# EasyEDA Pro project TJMakes_Xiao_Adapter.eprj

# Schematic schematic1
Create Date: 2024-02-23; Page Name: P1; Project Name: TJMakes_Xiao_Adapter; Schematic Name: schematic1; Update Date: 2024-02-27; Company: EasyEDA.com; Drawn: EasyEDA; Page Size: A4; Part Number: JLCPCB-002; Reviewed: EasyEDA; Version: V0.1
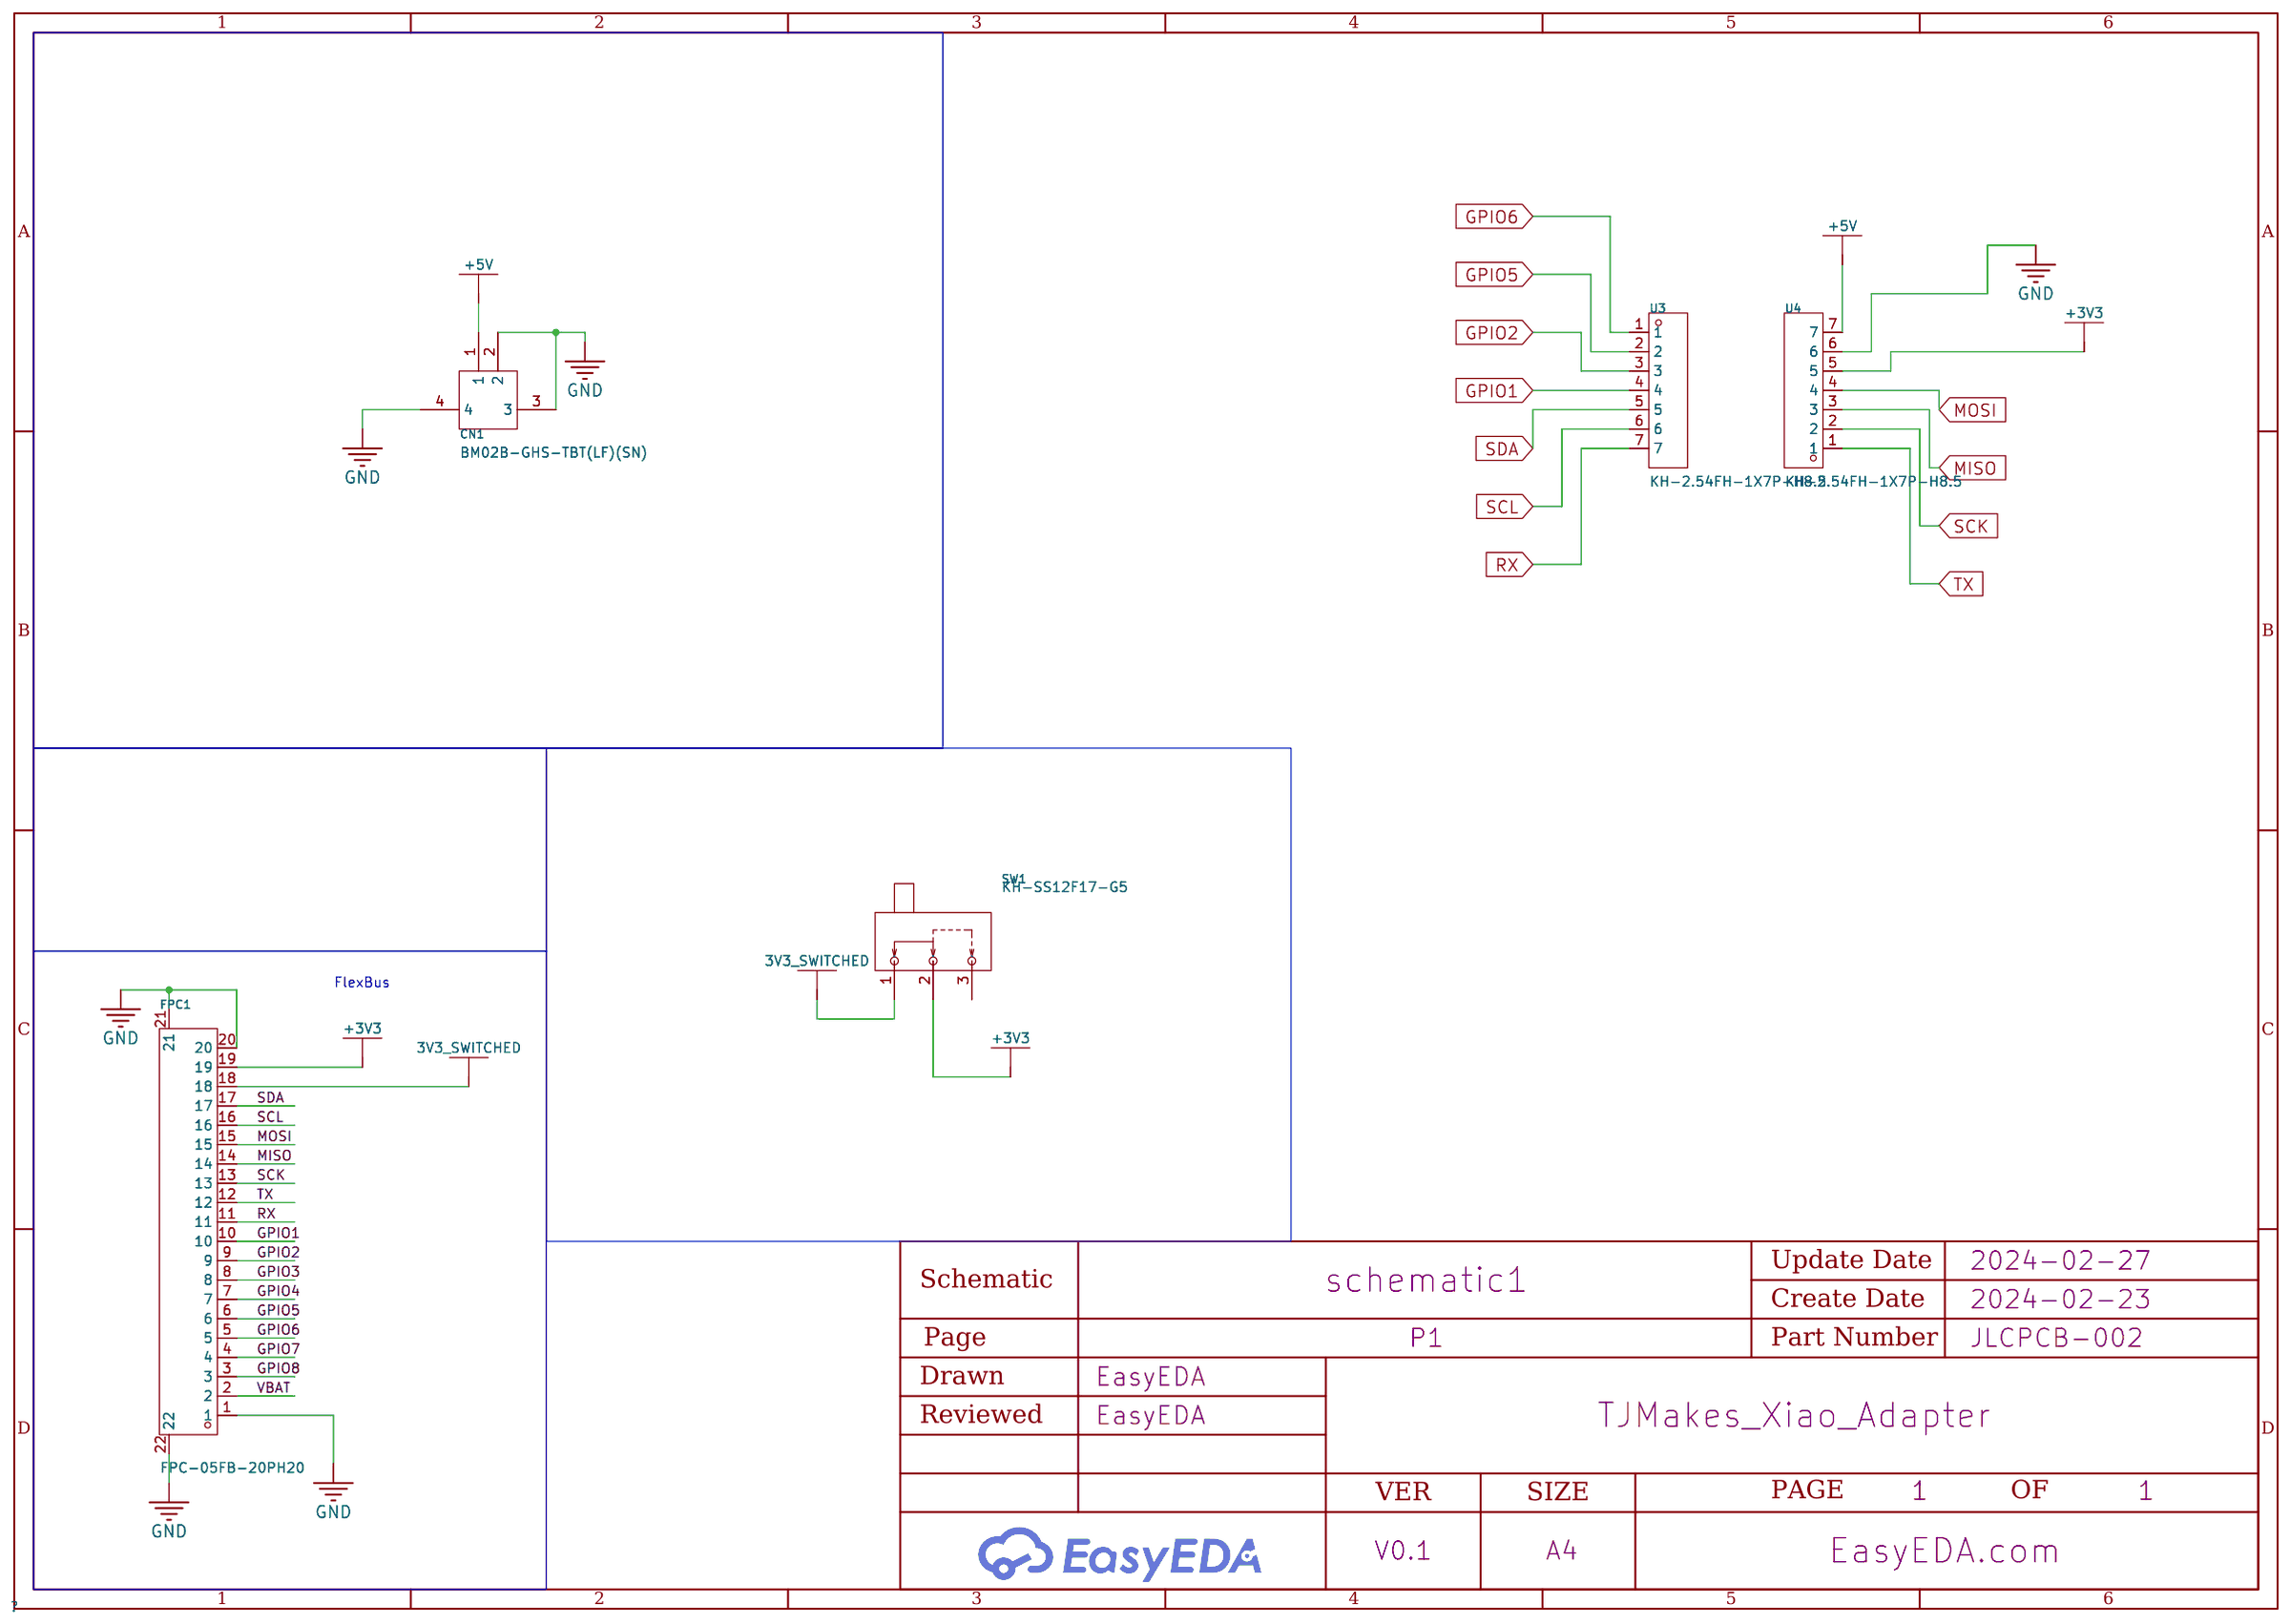
[diagram p0: schematic sheet]

## Parts
CN1  BM02B-GHS-TBT(LF)(SN)  [CONN-SMD_2P-P1.25_BM02B-GHS-TBT-LF-SN]
FPC1  FPC-05FB-20PH20  [FPC-SMD_20P-P0.50_FPC-05FB-20PH20]
SW1  KH-SS12F17-G5  [SW-TH_KH-SS12F17-G5]
U3  KH-2.54FH-1X7P-H8.5  [HDR-TH_7P-P2.54-V-F]
U4  KH-2.54FH-1X7P-H8.5  [HDR-TH_7P-P2.54-V-F]

## Library data of the parts
CN1 = BM02B-GHS-TBT(LF)(SN)_C161690: Pins Structure:1x2P Pitch:1.25mm Mounting Style:- Reference Series:GH Number of Pins:2P Number of Rows:1 Number of PINs Per Row:2 Row Spacing:- Contact Material:Phosphor bronze; LCSC Part Name: 系列:GH 间距:1.25mm 1x2P; Supplier Part: C161690; Manufacturer: JST; Supplier Footprint: SMD,P=1.25mm; JLCPCB Part Class: Extended Part; Datasheet: https://atta.szlcsc.com/upload/public/pdf/source/20181009/C265379_627E5111B25906DAAB327E382701D435.pdf; Supplier: LCSC; Pins Structure: 1x2P; Pitch: 1.25mm; Reference Series: GH; Number of Pins: 2P; Number of Rows: 1; Number of PINs Per Row: 2; Contact Material: Phosphor bronze
FPC1 = FPC-05FB-20PH20: Pitch:0.5mm Number of Contacts:20P Locking Feature:Clamshell FFC, FCB Thickness:0.3mm FFC, FCB Thickness:0.3mm Contact Type:Double-sided contacts/up and down connection Mounting Type:Surface Mount Height Above Board:2mm Operating Temperature Range:-25℃~+8; LCSC Part Name: 间距:0.5mm P数:20P 翻盖式 双侧触点/上下接; Supplier Part: C2856830; Manufacturer: XUNPU(讯普); Supplier Footprint: SMD,P=0.5mm,卧贴; JLCPCB Part Class: Extended Part; Datasheet: https://atta.szlcsc.com/upload/public/pdf/source/20210922/C2856830_32DC95BE77527398880E7D75F765EF2A.pdf; Supplier: LCSC; Pitch: 0.5mm; Number of Contacts: 20P; Locking Feature: Clamshell; FFC, FCB Thickness: 0.3mm; Contact Type: Double-sided contacts/up and down connection; Mounting Type: Surface Mount; Height Above Board: 2mm; Operating Temperature Range: -25℃~+85℃
SW1 = KH-SS12F17-G5: LCSC Part Name: 拨动开关 KH-SS12F17-G5; Supplier Part: C5274464; Manufacturer: kinghelm(金航标); Supplier Footprint: 插件; JLCPCB Part Class: Extended Part; Datasheet: https://atta.szlcsc.com/upload/public/pdf/source/20221118/A394A3D39A10FBA52FA26B90A9AAE8C2.pdf; Supplier: LCSC
U3 U4 = KH-2.54FH-1X7P-H8.5: Holes Structure:1x7P Pitch:2.54mm Row Spacing:- Circular Hole / Square Hole:Square Holes Mounting Type:Straight Number of Rows:Plugin Number of Holes:7P Current Rating (Max):3A Voltage Rating (Max):- Holes Direction:Top Insulation Height:8.5mm Operating T; LCSC Part Name: 间距:2.54mm 1x7P 直插; Supplier Part: C2932672; Manufacturer: kinghelm(金航标); Supplier Footprint: 插件,P=2.54mm; JLCPCB Part Class: Extended Part; Datasheet: https://atta.szlcsc.com/upload/public/pdf/source/20211220/BFE7372101EE9EB98F9C87A94A84703D.pdf; Supplier: LCSC; Holes Structure: 1x7P; Pitch: 2.54mm; Circular Hole / Square Hole: Square Holes; Mounting Type: Straight; Number of Rows: Plugin; Number of Holes: 7P; Current Rating (Max): 3A; Holes Direction: Top; Insulation Height: 8.5mm; Operating Temperature Range: -40℃~+105℃

## Nets
3V3_SWITCHED: FPC1.18 SW1.1
+3V3: FPC1.19 SW1.2 U4.5
+5V: CN1.1 U4.7
GND: CN1.2 CN1.3 CN1.4 FPC1.1 FPC1.20 FPC1.21 FPC1.22 U4.6
VBAT: FPC1.2
GPIO1: FPC1.10 U3.4
GPIO2: FPC1.9 U3.3
GPIO3: FPC1.8
GPIO4: FPC1.7
GPIO5: FPC1.6 U3.2
GPIO6: FPC1.5 U3.1
GPIO7: FPC1.4
GPIO8: FPC1.3
MISO: FPC1.14 U4.3
MOSI: FPC1.15 U4.4
RX: FPC1.11 U3.7
SCK: FPC1.13 U4.2
SCL: FPC1.16 U3.6
SDA: FPC1.17 U3.5
TX: FPC1.12 U4.1

Not connected (* = marked no-connect by the designer): SW1 3

## Notes on the sheet
- FlexBus

# Board PCB1
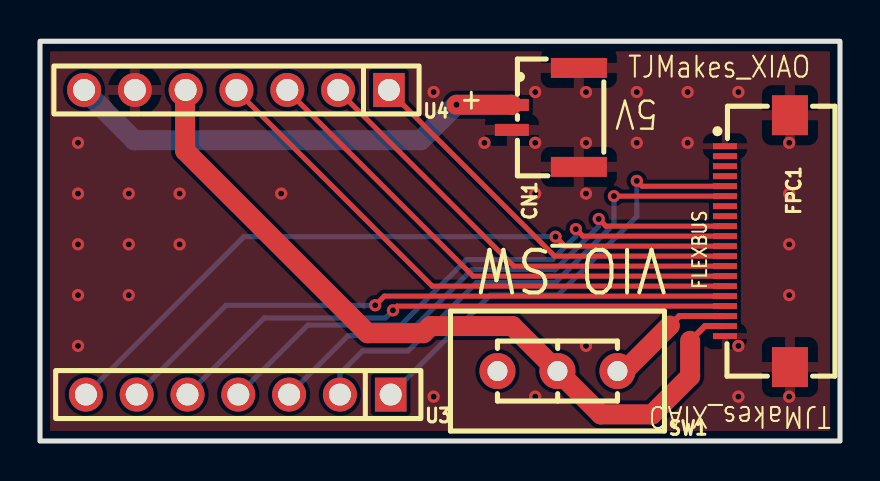
[diagram p1: board, top side]
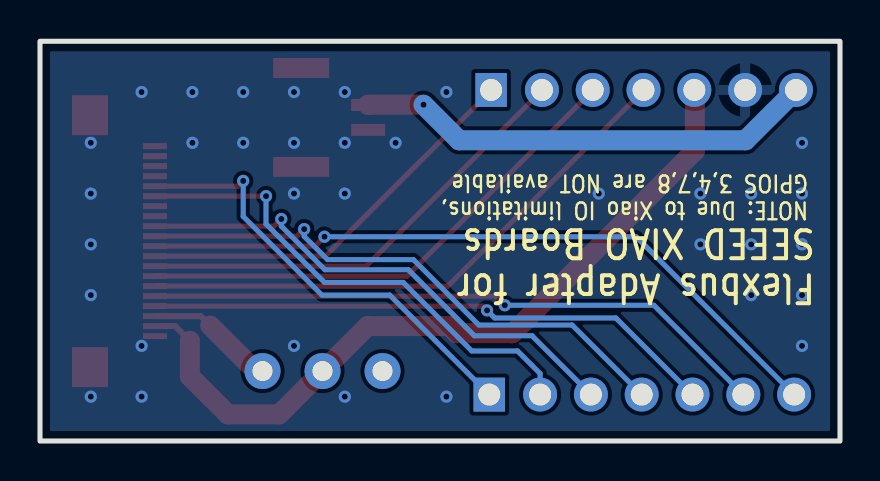
[diagram p2: board, bottom side, seen from below]

Outline 40 x 20 mm; copper layers: Top Layer, Bottom Layer. Coordinates in mm from the lower left corner of the outline.
Outline path: rectangle 40,0 0,20
Stack: Top Layer 0.035mm / Dielectric1 1.51mm FR4 er 4.5 / Bottom Layer 0.035mm

## Design rules (mm)
template: JLCPCB Capability(Two Layers Board)
spacing copperThickness1oz (default): track to track 0.102, other pairs 0.152 to 0.3
spacing copperThickness2oz: track to track 0.203, other pairs 0.152 to 0.3
track width copperThickness1oz (default): min 0.127, default 0.254, max 2.54
track width copperThickness2oz: min 0.203, default 0.254, max 2.54
differential pair differentialPair (default): width min 0.127, default 0.254, max 2.54; gap min 0.152, default 0.152
via viaSize (default): diameter min 0.5, default 0.61, max 10; hole min 0.3, default 0.305, max 6.3

## Placement (name value [footprint] x y rotation side)
CN1  BM02B-GHS-TBT(LF)(SN)  [CONN-SMD_2P-P1.25_BM02B-GHS-TBT-LF-SN]  25.27 16.19 90 top
FPC1  FPC-05FB-20PH20  [FPC-SMD_20P-P0.50_FPC-05FB-20PH20]  35.87 10 90 top
SW1  KH-SS12F17-G5  [SW-TH_KH-SS12F17-G5]  25.87 3.5 180 top
U3  KH-2.54FH-1X7P-H8.5  [HDR-TH_7P-P2.54-V-F]  9.92 2.32 180 top
U4  KH-2.54FH-1X7P-H8.5  [HDR-TH_7P-P2.54-V-F]  9.82 17.56 180 top

## Footprints (pads in the part's own frame, mm; a bottom-side part is the same pattern mirrored in y, then rotated)
CONN-SMD_2P-P1.25_BM02B-GHS-TBT-LF-SN
  rect 0.6x1.7 smd: 1(0.625,1.675) 2(-0.625,1.675)
  rect 1x2.8 smd: 3(2.475,-1.675) 4(-2.475,-1.675)
FPC-SMD_20P-P0.50_FPC-05FB-20PH20
  rect 0.3x1.2 smd: 1(4.75,1.625) 2(4.25,1.625) 3(3.75,1.625) 4(3.25,1.625) 5(2.75,1.625) 6(2.25,1.625) 7(1.75,1.625) 8(1.25,1.625) 9(0.75,1.625) 10(0.25,1.625) 11(-0.25,1.625) 12(-0.75,1.625) 13(-1.25,1.625) 14(-1.75,1.625) 15(-2.25,1.625) 16(-2.75,1.625) 17(-3.25,1.625) 18(-3.75,1.625) 19(-4.25,1.625) 20(-4.75,1.625)
  rect 2x1.8 smd: 21(-6.3,-1.625) 22(6.3,-1.625)
HDR-TH_7P-P2.54-V-F
  rect 1.575x1.7 hole 1.1: 1(-7.62,0)
  round 1.7 hole 1.1: 2(-5.08,0) 3(-2.54,0) 4(0,0) 5(2.54,0) 6(5.08,0) 7(7.62,0)
SW-TH_KH-SS12F17-G5
  round 1.8 hole 1: 1(-3,0) 2(0,0) 3(3,0)

## Nets
As in the schematic.

Pads without a net: SW1 3

## Via types
v1: diameter 0.61, hole 0.304, Top Layer to Bottom Layer, 34 vias
v2: diameter 0.61, hole 0.305, Top Layer to Bottom Layer, 8 vias

## Routing (per net, layer and track width the routed paths; a pad name or vN(x,y) marks a point on that pad's centre or on a via; arc(x,y) is an arc through that point)
3V3_SWITCHED: length 6.5
  Top Layer w0.3: FPC1.18 31.97,6.25 31.49,5.78
  Top Layer w1: 31.49,5.78 29.22,3.5 SW1.1
+3V3: length 38.7
  Top Layer w0.3: 32.51,5.01 33.24,5.75 FPC1.19
  Top Layer w1: 32.51,5.01 32.51,3.24 30.6,1.33 28.04,1.33 SW1.2 23.62,5.75 19.53,5.75 19.17,5.39 16.38,5.39 7.26,14.52 7.26,17.56
+5V: length 23.2
  Top Layer w1: CN1.1 23.58,16.83 v2(20.82,16.83)
  Bottom Layer w1: v2(20.82,16.83) 19.05,15.05 4.72,15.05 U4.7
GND:
  vias: v1(1.9,14.92) v1(1.9,12.38) v1(1.9,9.84) v1(1.9,7.3) v1(1.9,4.76) v1(4.44,12.38) v1(4.44,9.84) v1(4.44,7.3) v1(6.98,12.38) v1(6.98,9.84) v1(12.06,12.38) v1(19.68,17.46) v1(19.68,2.22) v1(22.22,14.92) v1(24.76,17.46) v1(24.76,14.92) v1(24.76,12.38) v1(24.76,2.22) v1(27.3,17.46) v1(27.3,14.92) v1(27.3,12.38) v1(27.3,4.76) v1(29.84,17.46) v1(29.84,14.92) v1(32.38,17.46) v1(32.38,14.92) v1(34.92,17.46) v1(34.92,4.76) v1(34.92,2.22) v1(37.46,14.92) v1(37.46,12.38) v1(37.46,9.84) v1(37.46,7.3) v1(37.46,2.22)
GPIO1: length 28.1
  Top Layer w0.254: v2(26.79,10.6) 27.14,10.25 FPC1.10
  Bottom Layer w0.254: U3.4 13.39,5.8 18.05,5.8 21.33,9.08 25.63,9.08 26.79,10.24 v2(26.79,10.6)
GPIO2: length 25.8
  Top Layer w0.254: v2(27.94,11.11) 28.3,10.75 FPC1.9
  Bottom Layer w0.254: v2(27.94,11.11) 27.94,10.75 25.75,8.57 21.59,8.57 18.28,5.27 15.4,5.27 U3.3
GPIO5: length 24.8
  Top Layer w0.254: FPC1.6 34.25,12.25 v2(28.7,12.25)
  Bottom Layer w0.254: U3.2 15,3.38 16.12,4.51 18.41,4.51 21.84,7.94 25.78,7.94 28.7,10.86 v2(28.7,12.25)
GPIO6: length 22.3
  Top Layer w0.254: FPC1.5 30.11,12.75 v2(29.84,13.02)
  Bottom Layer w0.254: v2(29.84,13.02) 29.84,11.24 25.9,7.3 22.51,7.3 U3.1
MISO: length 25.8
  Top Layer w0.254: FPC1.14 21.65,8.25 12.34,17.56
MOSI: length 28.5
  Top Layer w0.254: FPC1.15 19.61,7.75 9.8,17.56
RX: length 35.4
  Top Layer w0.254: FPC1.11 26.25,9.75 v2(25.78,10.22)
  Bottom Layer w0.254: U3.7 10.19,10.22 v2(25.78,10.22)
SCK: length 23
  Top Layer w0.254: FPC1.13 23.69,8.75 14.88,17.56
SCL: length 31.5
  Top Layer w0.254: v2(16.76,6.79) 17.22,7.25 FPC1.16
  Bottom Layer w0.254: v2(16.76,6.79) 9.3,6.79 U3.6
SDA: length 28.7
  Top Layer w0.254: v2(17.65,6.54) 17.86,6.75 FPC1.17
  Bottom Layer w0.254: U3.5 11.21,6.16 17.27,6.16 v2(17.65,6.54)
TX: length 20.3
  Top Layer w0.254: 17.42,17.56 25.73,9.25 FPC1.12

## Copper pours and planes (outline as drawn; the poured copper is in the pictures)
GND on Top Layer: 40,0 0,0 0,20 40,20
GND on Bottom Layer: 40,0 0,0 0,20 40,20

## Text on the board
Bottom Silkscreen Layer: NOTE: Due to Xiao IO limitations, / GPIOS 3,4,7,8 are NOT available | Flexbus Adapter for / SEEED XIAO Boards
Top Silkscreen Layer: FLEXBUS | TJMakes_XIAO | + | 5V | VIO_SW
